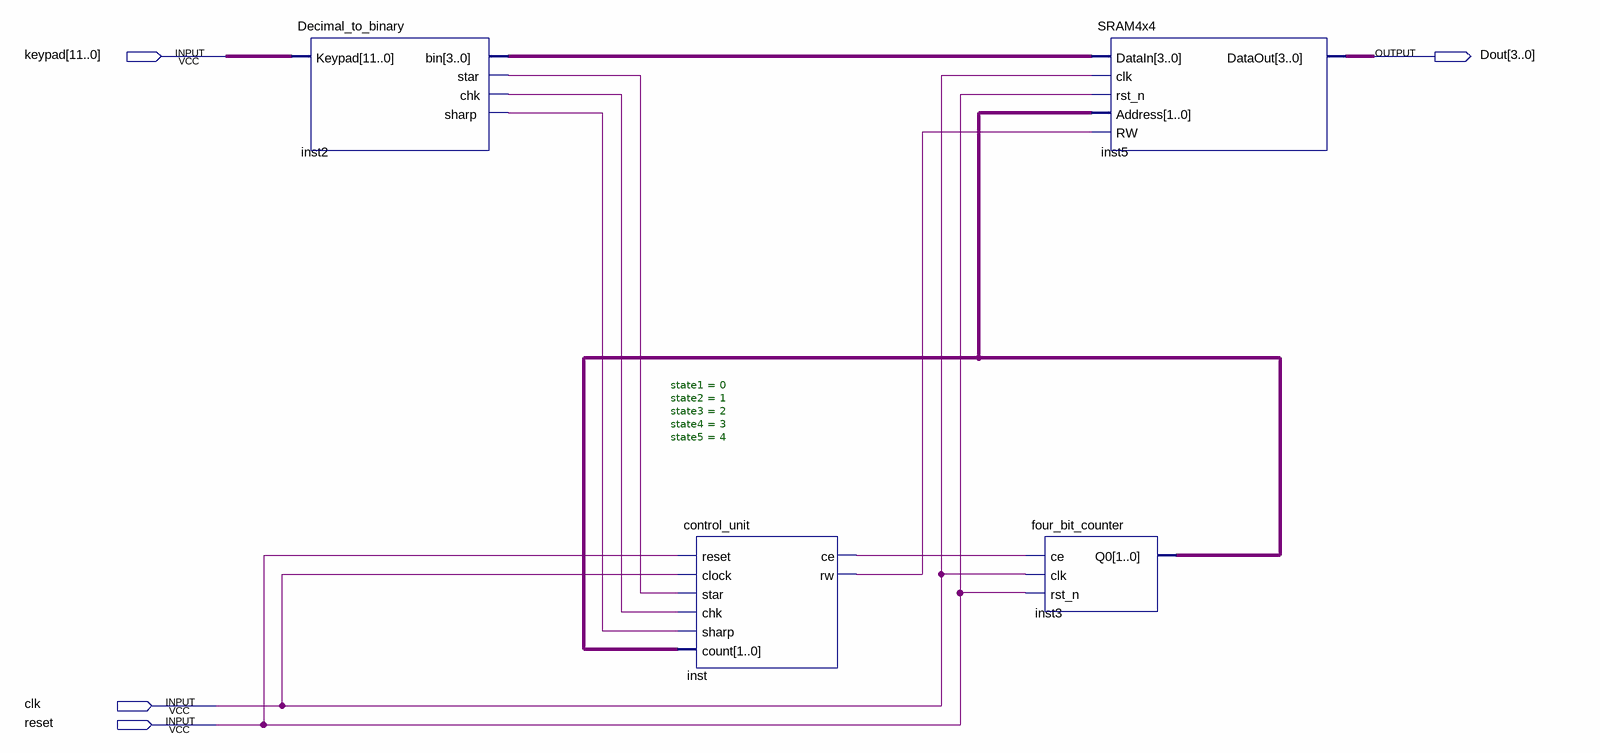
[diagram p0: schematic sheet]
// Quartus schematic keypad_SRAM4.bdf as structural Verilog: 4 symbols, 4 pins
module keypad_SRAM4 (
  input  [11:0] keypad,
  input  clk,
  input  reset,
  output [3:0] Dout
);

  wire inst2_chk, inst2_sharp, inst2_star, inst_ce, inst_rw;
  wire [1:0] inst3_q0;
  wire [3:0] inst2_bin;

  Decimal_to_binary inst2 (.Keypad(keypad), .bin(inst2_bin), .star(inst2_star), .chk(inst2_chk), .sharp(inst2_sharp));
  control_unit #(.state1(0), .state2(1), .state3(2), .state4(3), .state5(4)) inst (
    .reset(reset), .clock(clk), .star(inst2_star), .chk(inst2_chk), .sharp(inst2_sharp), .count(inst3_q0),
    .ce(inst_ce), .rw(inst_rw));
  four_bit_counter inst3 (.ce(inst_ce), .clk(clk), .rst_n(reset), .Q0(inst3_q0));
  SRAM4x4 inst5 (.DataIn(inst2_bin), .clk(clk), .rst_n(reset), .Address(inst3_q0), .RW(inst_rw), .DataOut(Dout));
endmodule
